# Altium schematic sheet Game_Consol_Power.SchDoc: Game_Consol_Power
size A4; CompanyName: University of Melbourne; DrawnBy: 819595; Engineer: Indunil Punchihewa; Organization: University of Melbourne; DocumentNumber: 1; Revision: 0.1; SheetNumber: 2; SheetTotal: 4; Title_Project: ESD Game Consoler
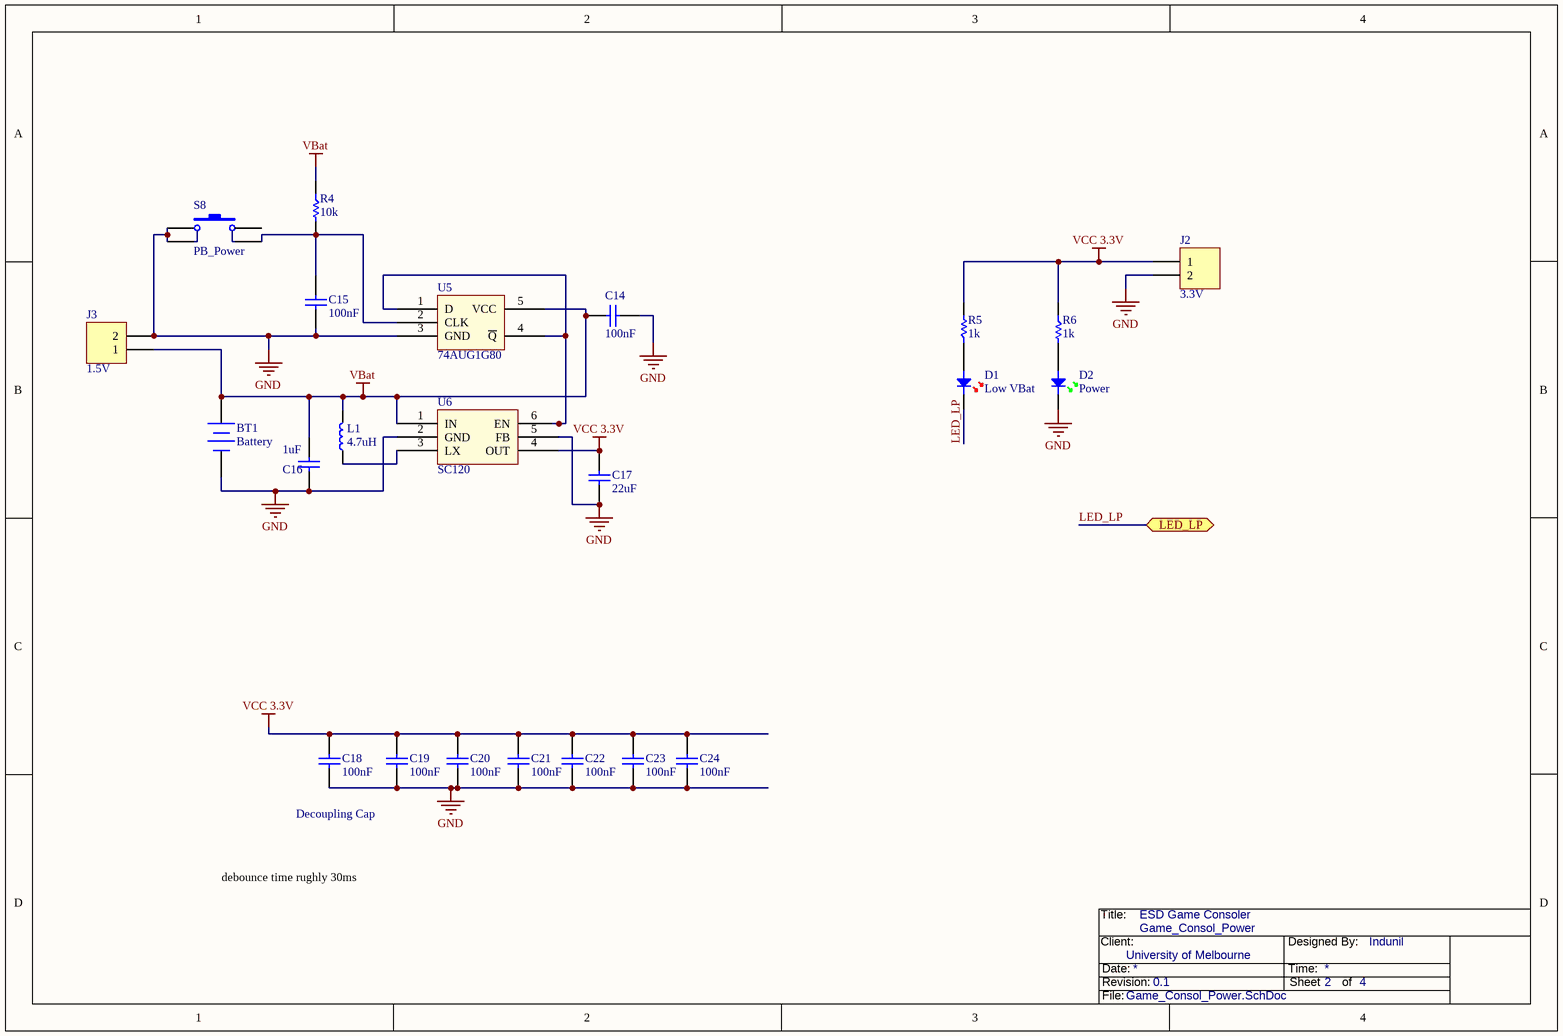
[diagram p0: Game_Consol_Power.SchDoc]

## Parts
BT1  Battery  [BATT_HOLDER]
C14  100nF  [0805]
C15  100nF  [0805]
C16  1uF  [0805]
C17  22uF  [1210]
C18  100nF  [0805]
C19  100nF  [0805]
C20  100nF  [0805]
C21  100nF  [0805]
C22  100nF  [0805]
C23  100nF  [0805]
C24  100nF  [0805]
D1  Low VBat  [0805D]
D2  Power  [0805D]
J2  3.3V  [HDR1X2]
J3  1.5V  [HDR1X2]
L1  4.7uH  [1210L]
R4  10k  [0805]
R5  1k  [0805]
R6  1k  [0805]
S8  PB_Power  [SPNO_SMD]
U5  74AUG1G80  [SOT23-5]
U6  SC120  [SOT23-6]

## Ports
LED_LP (bidir)

## Nets
GND: BT1.2(-) C14.1 C15.2 C16.2 C17.2 C18.2 C19.2 C20.2 C21.2 C22.2 C23.2 C24.2 D2.K J2.2 J3.2 S8.1 S8.2 U5.3(GND) U6.2(GND) U6.5(FB)
VBat: BT1.1(+) C14.2 C16.1 J3.1 L1.2 R4.1 U5.5(VCC) U6.1(IN)
VCC 3.3V: C17.1 C18.1 C19.1 C20.1 C21.1 C22.1 C23.1 C24.1 J2.1 R5.2 R6.1 U6.4(OUT)
LED_LP: D1.K ; port LED_LP
NetC15_1: C15.1 R4.2 S8.4 U5.2(CLK)
NetD1_A: D1.A R5.1
NetD2_A: D2.A R6.2
NetL1_1: L1.1 U6.3(LX)
NetU5_1: U5.1(D) U5.4(~{Q}) U6.6(EN)

Not connected (* = marked no-connect by the designer): S8 3

## Notes on the sheet
- Decoupling Cap
- debounce time rughly 30ms
- Title:
- Client:
- Date:
- Revision:
- Time:
- Designed By:
- Sheet
- of
- Indunil
- File:

## Library data of the parts
BT1 = Battery: Multicell Battery; Published: 24-Mar-1999; LatestRevisionDate: 17-Jul-2002; LatestRevisionNote: Re-released for DXP Platform.; PackageReference: BAT-2; Publisher: Altium Limited; PackageDescription: Battery; 2 Leads
C14-C16 C18-C24 = C 0805: Capacitor 100nF; Class I: Passive; Revision: July-2002: Re-released for DXP Platform.
  C14 C15 C18-C24: Value: 100nF
  C16: Value: 1uF
C17 = C 1210: Capacitor 22uF; Manufacturer: Generic Components; Manufacturer Part Number: LMK316F226ZL-T; Class I: Passive; Capacitance: 22µF; Voltage - Rated: 10V; Tolerance: -20%, +80%; Temperature Coefficient: Y5V (F); Published: 8-Jun-2000; Revision: July-2002: Re-released for DXP Platform.; Publisher: Altium Limited; Class II: Capacitor; Supplier 1: Digi-Key; RoHS: RoHS Compliant; Category: Capacitors; Stock 1: 33004; Pricing 1: 1=0.3, 10=0.254, 50=0.143, 100=0.1271, 250=0.09532, 500=0.08418, 1000=0.07465 (AUD); Mounting Type: Surface Mount, MLCC; Operating Temperature: -30°C ~ 85°C; Applications: General Purpose; Ratings: -; Package / Case: 1206 (3216 Metric); Size / Dimension: 0.126" L x 0.063" W (3.20mm x 1.60mm); Height - Seated (Max): -; Thickness (Max): 0.071" (1.80mm); Lead Spacing: -; Features: -; Packaging: Cut Tape (CT); Lead Style: -; ComponentLink1URL: http://www.yuden.co.jp/or/product/category/capacitor/LMK316F226ZL-T.pdf; ComponentLink1Description: http://www.yuden.co.jp/or/product/category/capacitor/LMK316F226ZL-T.pdf; Supplier Part Number 1: 587-1356-1-ND; Value: 22uF
D1 = LED RED: Light Emitting Diode; Manufacturer: Generic Components; Class I: Discrete; Class II: Diode - Switching; Published: 8-Jun-2000; Revision: July-2002: Re-released for DXP Platform.; Publisher: Altium Limited
D2 = LED GREEN: Light Emitting Diode; Manufacturer: Generic Components; Class I: Discrete; Class II: Diode - Switching; Published: 8-Jun-2000; Revision: July-2002: Re-released for DXP Platform.; Publisher: Altium Limited
J2 J3 = HDR2: 2 Pin Header; LatestRevisionDate: 17-Jul-2002; LatestRevisionNote: Re-released for DXP Platform.; Publisher: Altium Limited
L1 = I 1210: Inductor 4.7uH; Manufacturer: Murata Electronics North America; Manufacturer Part Number: LQH32CN4R7M23L; Code_IEC: 1005; Inductance: 4.7µH; Current: 450mA; Type: Ferrite Core; Tolerance: ±20%; Shielding: Unshielded; DC Resistance (DCR): 260 mOhm Max; Frequency - Self Resonant: 43MHz; Material - Core: Ferrite; Frequency - Test: 1MHz; Published: 8-Jun-2000; LatestRevisionDate: 17-Jul-2002; LatestRevisionNote: Re-released for DXP Platform.; PackageReference: 0402-A; Publisher: Altium Limited; Code_JEITA: 0402; Class II: Inductor; Supplier 1: Digi-Key; RoHS: RoHS Compliant; Category: Inductors, Coils, Chokes; Stock 1: 31057; Pricing 1: 1=0.34, 10=0.313, 25=0.2784, 50=0.2436, 100=0.2261, 250=0.20868, 500=0.19824, 750=0.18084, 1000=0.15998 (AUD); Current - Saturation: -; Current - Temperature Rise: -; Q @ Freq: -; Applications: Power Supplies; Package / Case: 1210 (3225 Metric); Mounting Type: Surface Mount; Packaging: Cut Tape (CT); Operating Temperature: -40°C ~ 85°C; ComponentLink1URL: http://search.murata.co.jp/Ceramy/image/img/PDF/ENG/L0075S0093LQH32C_23~33.pdf; ComponentLink1Description: http://search.murata.co.jp/Ceramy/image/img/PDF/ENG/L0075S0093LQH32C_23~33.pdf; Supplier Part Number 1: 490-2495-1-ND; Value: 4.7uH
R4-R6 = R: Resistor
  R4: Value: 10k
  R5 R6: Value: 1k
S8 = SW-PB: Push Button Switch; Manufacturer: TE Connectivity; Manufacturer Part Number: FSM4JSMA; Circuit: SPST-NO; Switch Function: Off-Mom; Contact Rating @ Voltage: 0.05A @ 12VDC; Actuator Type: Standard; Actuator Orientation: Top Actuated; Outline: 6.00mm x 6.00mm; Illumination: Non-Illuminated; Operating Force: 160gf; Published: 24-Mar-1999; LatestRevisionDate: 17-Jul-2002; LatestRevisionNote: Re-released for DXP Platform.; PackageReference: SPST-2; Publisher: Altium Limited; PackageDescription: Switch; 2 Leads; Supplier 1: Digi-Key; RoHS: RoHS Compliant; Category: Switches; Stock 1: 30338; Pricing 1: 1=0.28, 10=0.265, 25=0.2256, 50=0.1974, 100=0.1834, 250=0.1622, 500=0.15516, 1000=0.12694, 5000=0.10579 (AUD); Mounting Type: Surface Mount; Termination Style: Gull Wing; Packaging: Bulk; ComponentLink1URL: http://documents.tycoelectronics.com/commerce/DocumentDelivery/DDEController?Action=srchrtrv&DocNm=2-1437565-7&DocType=CD&DocLang=EN; ComponentLink1Description: http://documents.tycoelectronics.com/commerce/DocumentDelivery/DDEController?Action=srchrtrv&DocNm=2-1437565-7&DocType=CD&DocLang=EN; Supplier Part Number 1: 450-1129-ND
U5 = 74AUG1G80: Inverted single D flip flop
U6 = SC120: Regulator Low Voltage